# Altium schematic sheet 4-PWR_MANAGE_3.SCHDOC
size A4
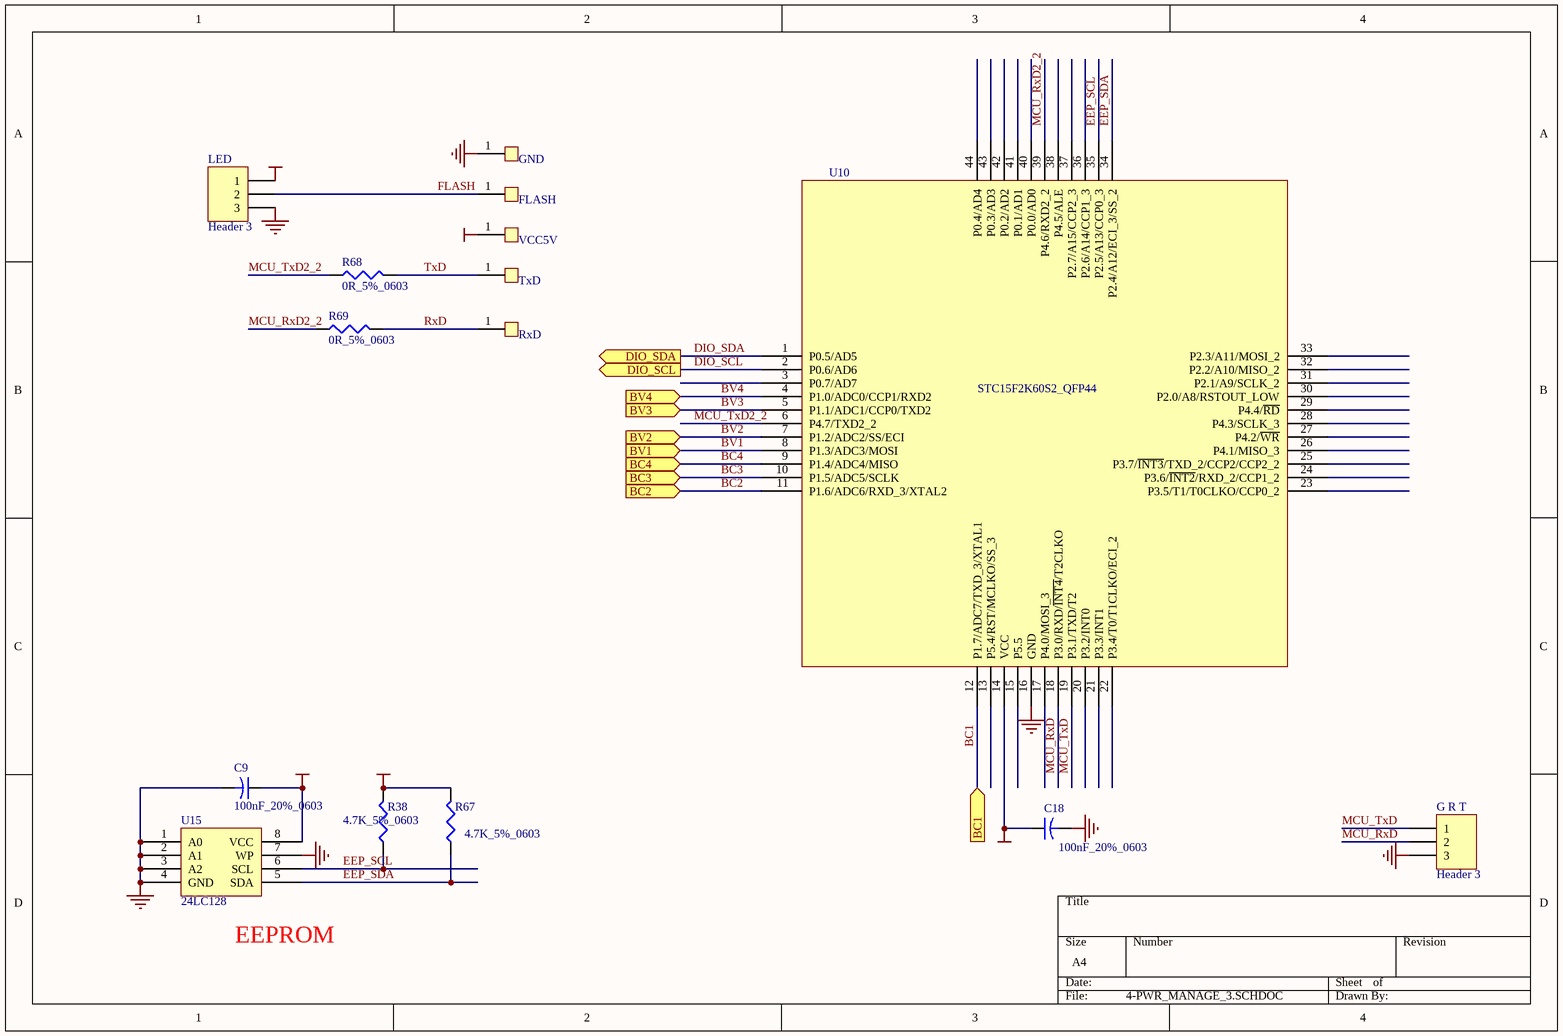
[diagram p0: 4-PWR_MANAGE_3.SCHDOC]

## Parts
C9  100nF_20%_0603  [C1608-0603]
C18  100nF_20%_0603  [C1608-0603]
FLASH  ND  [END_3_6]  (value not drawn)
G_R_T  Header 3  [XH-03H-R]
GND  ND  [END_3_6]  (value not drawn)
LED  Header 3  [VH-03H]
R38  4.7K_5%_0603  [C1608-0603]
R67  4.7K_5%_0603  [C1608-0603]
R68  0R_5%_0603  [C1608-0603]
R69  0R_5%_0603  [C1608-0603]
RxD  ND  [END_3_6]  (value not drawn)
TxD  ND  [END_3_6]  (value not drawn)
U10  STC15F2K60S2_QFP44  [PQFP44]
U15  24LC128  [8s1]
VCC5V  ND  [END_3_6]  (value not drawn)

## Ports
BC1 (in), BC2 (in), BC3 (in), BC4 (in), BV1 (in), BV2 (in), BV3 (in), BV4 (in), DIO_SCL (out), DIO_SDA (out)

## Nets
GND: C9.2 C18.2 G_R_T.3 GND.1(SW) LED.3 U10.16(GND) U15.1(A0) U15.2(A1) U15.3(A2) U15.4(GND) U15.7(WP)
VCC_3V3: C9.1 C18.1 R38.2 R67.2 U10.14(VCC) U15.8(VCC)
VCC_5V: VCC5V.1(SW)
VCC_BAT: LED.1
BC1: U10.12(P1.7/ADC7/TXD_3/XTAL1) ; port BC1
BC2: U10.11(P1.6/ADC6/RXD_3/XTAL2) ; port BC2
BC3: U10.10(P1.5/ADC5/SCLK) ; port BC3
BC4: U10.9(P1.4/ADC4/MISO) ; port BC4
BV1: U10.8(P1.3/ADC3/MOSI) ; port BV1
BV2: U10.7(P1.2/ADC2/SS/ECI) ; port BV2
BV3: U10.5(P1.1/ADC1/CCP0/TXD2) ; port BV3
BV4: U10.4(P1.0/ADC0/CCP1/RXD2) ; port BV4
DIO_SCL: U10.2(P0.6/AD6) ; port DIO_SCL
DIO_SDA: U10.1(P0.5/AD5) ; port DIO_SDA
EEP_SCL: R38.1 U10.35(P2.5/A13/CCP0_3) U15.6(SCL)
EEP_SDA: R67.1 U10.34(P2.4/A12/ECI_3/SS_2) U15.5(SDA)
FLASH: FLASH.1(SW) LED.2
MCU_RxD: G_R_T.2 U10.18(P3.0/RXD/~{INT4}/T2CLKO)
MCU_RxD2_2: R69.1 U10.39(P4.6/RXD2_2)
MCU_TxD: G_R_T.1 U10.19(P3.1/TXD/T2)
MCU_TxD2_2: R68.1 U10.6(P4.7/TXD2_2)
RxD: R69.2 RxD.1(SW)
TxD: R68.2 TxD.1(SW)

Not connected (* = marked no-connect by the designer): U10 3(P0.7/AD7) 13(P5.4/RST/MCLKO/SS_3) 15(P5.5) 17(P4.0/MOSI_3) 20(P3.2/INT0) 21(P3.3/INT1) 22(P3.4/T0/T1CLKO/ECI_2) 23(P3.5/T1/T0CLKO/CCP0_2) 24(P3.6/~{INT2}/RXD_2/CCP1_2) 25(P3.7/~{INT3}/TXD_2/CCP2/CCP2_2) 26(P4.1/MISO_3) 27(P4.2/~{WR}) 28(P4.3/SCLK_3) 29(P4.4/~{RD}) 30(P2.0/A8/RSTOUT_LOW) 31(P2.1/A9/SCLK_2) 32(P2.2/A10/MISO_2) 33(P2.3/A11/MOSI_2) 36(P2.6/A14/CCP1_3) 37(P2.7/A15/CCP2_3) 38(P4.5/ALE) 40(P0.0/AD0) 41(P0.1/AD1) 42(P0.2/AD2) 43(P0.3/AD3) 44(P0.4/AD4)

## Notes on the sheet
- (near U15) EEPROM

## Library data of the parts
C9 = Cap2: Capacitor; Value: 0.1uF 0603; Published: 23-Sep-2002; Publisher: Altium Limited
C18 = Cap2: Capacitor; Value: 0.1uF 20% 0603; Published: 23-Sep-2002; Publisher: Altium Limited
G_R_T LED = Header 3: Header, 3-Pin; LatestRevisionDate: 17-Jul-2002; LatestRevisionNote: Re-released for DXP Platform.; Publisher: Altium Limited
R38 R67-R69 = Res3: Resistor; Value: 1K%5 0603; Published: 8-Jun-2000; Revision: July-2002: Re-released for DXP Platform.; Publisher: Altium Limited
U15 = 24LC02: IC